# Altium schematic sheet FPGA_GTP.SchDoc
size 420 x 297 mm; EDA_Number: ARTIQ; CompanyName: WUT ISE; Organization: WUT ISE; DocumentNumber: 13; SheetNumber: 4; Title2: FPGA GTP; ModifiedDate: -
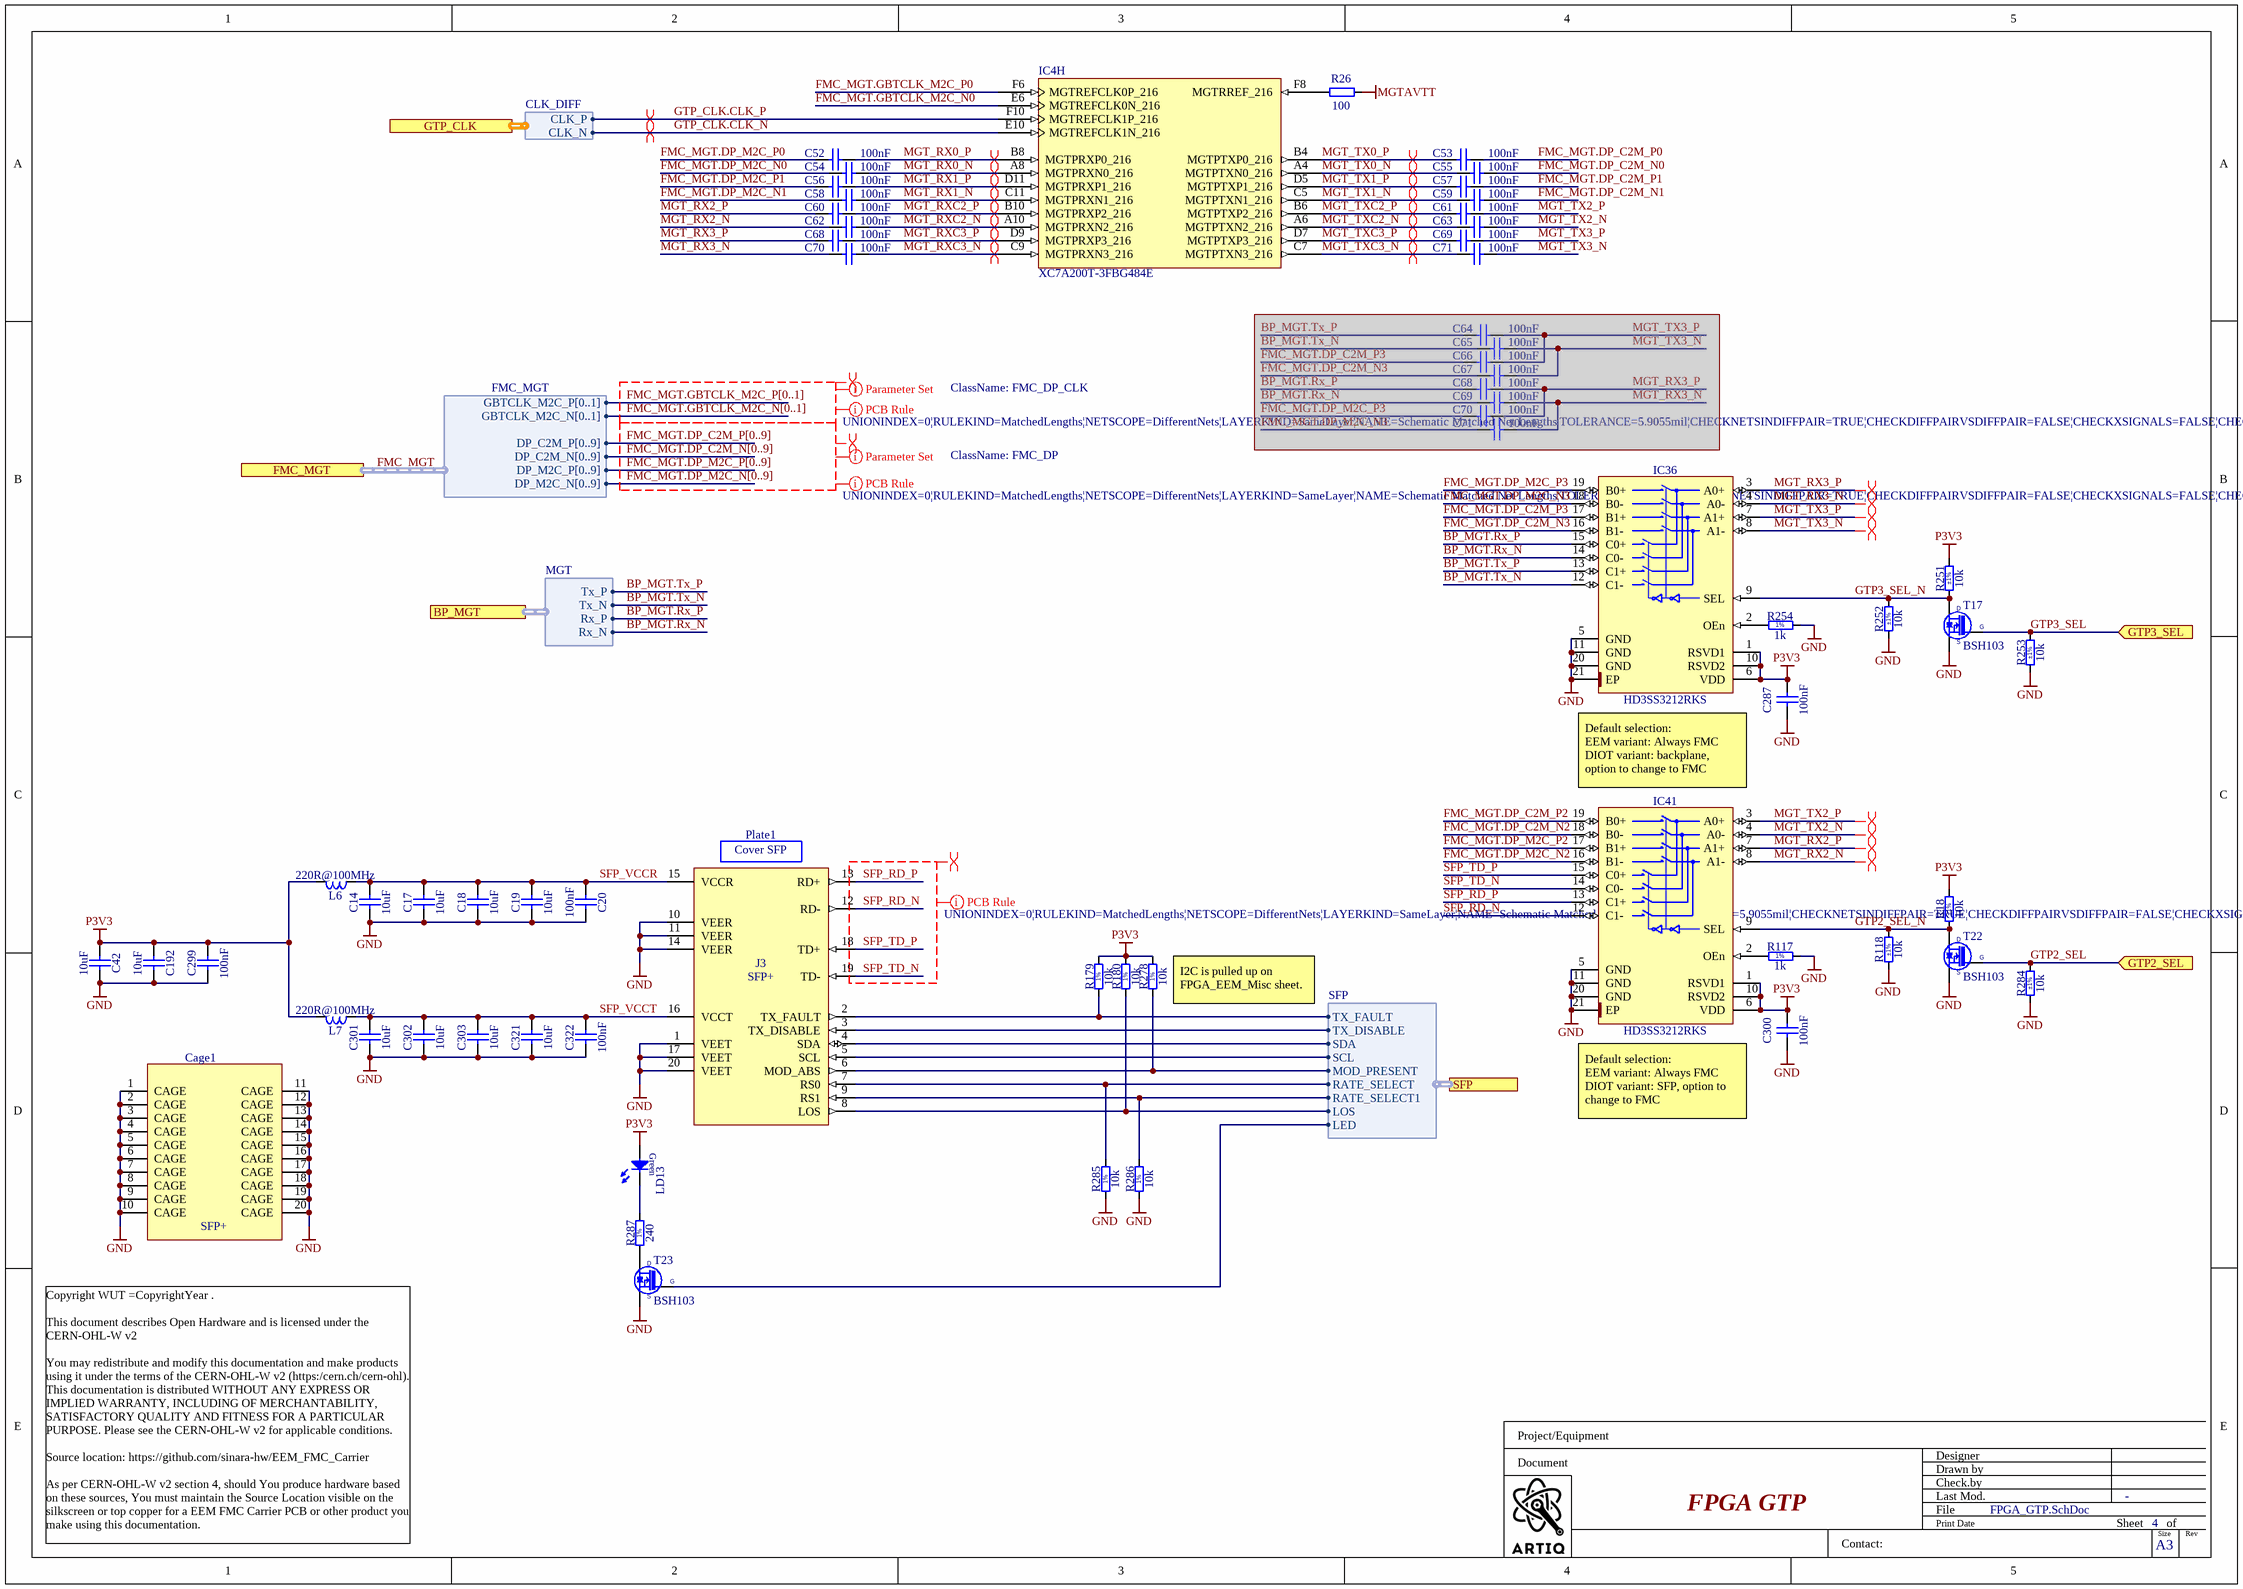
[diagram p0: FPGA_GTP.SchDoc]

## Parts
(Parts that share a designator on the sheet are numbered #1, #2 ... from top to bottom, then left to right.)
C14  10uF  [CAPC1005X70N]
C17  10uF  [CAPC1005X70N]
C18  10uF  [CAPC1005X70N]
C19  10uF  [CAPC1005X70N]
C20  100nF  [CAPC1005X55N]
C42  10uF  [CAPC1005X70N]
C52  100nF  [CAPC0603X33N]
C53  100nF  [CAPC0603X33N]
C54  100nF  [CAPC0603X33N]
C55  100nF  [CAPC0603X33N]
C56  100nF  [CAPC0603X33N]
C57  100nF  [CAPC0603X33N]
C58  100nF  [CAPC0603X33N]
C59  100nF  [CAPC0603X33N]
C60  100nF  [CAPC0603X33N]
C61  100nF  [CAPC0603X33N]
C62  100nF  [CAPC0603X33N]
C63  100nF  [CAPC0603X33N]
C64  100nF  [CAPC0603X33N]  (masked out: inside a compile mask, not in the netlist)
C65  100nF  [CAPC0603X33N]  (masked out: inside a compile mask, not in the netlist)
C66  100nF  [CAPC0603X33N]  (masked out: inside a compile mask, not in the netlist)
C67  100nF  [CAPC0603X33N]  (masked out: inside a compile mask, not in the netlist)
C68#1  100nF  [CAPC0603X33N]
C68#2  100nF  [CAPC0603X33N]  (masked out: inside a compile mask, not in the netlist)
C69#1  100nF  [CAPC0603X33N]
C69#2  100nF  [CAPC0603X33N]  (masked out: inside a compile mask, not in the netlist)
C70#1  100nF  [CAPC0603X33N]
C70#2  100nF  [CAPC0603X33N]  (masked out: inside a compile mask, not in the netlist)
C71#1  100nF  [CAPC0603X33N]
C71#2  100nF  [CAPC0603X33N]  (masked out: inside a compile mask, not in the netlist)
C192  10uF  [CAPC1005X70N]
C287  100nF  [CAPC1005X55N]
C299  100nF  [CAPC1005X55N]
C300  100nF  [CAPC1005X55N]
C301  10uF  [CAPC1005X70N]
C302  10uF  [CAPC1005X70N]
C303  10uF  [CAPC1005X70N]
C321  10uF  [CAPC1005X70N]
C322  100nF  [CAPC1005X55N]
Cage1  SFP+  [TYCO_2007198-1]
IC4  XC7A200T-3FBG484E  [BGA484C100P22X22_2300X2300X254]  (part H of 10)
IC36  HD3SS3212RKS  [TEXAS_RKS0020A]
IC41  HD3SS3212RKS  [TEXAS_RKS0020A]
J3  SFP+  [TYCO_1888247-1]
L6  220R@100MHz  [INDC2012X105N]
L7  220R@100MHz  [INDC2012X105N]
LD13  Green  [LED_AVAGO_HSME-C120]  (value not drawn)
Plate1  Cover SFP  [AMPHENOL_U77A11108000P]
R18  10k  Tolerance: ±1%  [RESC1005X40N]
R26  100  [RESC0603X28N]
R117  1k  [RESC1005X40N]
R118  10k  Tolerance: ±1%  [RESC1005X40N]
R179  10k  [RESC1005X40N]
R180  10k  [RESC1005X40N]
R251  10k  Tolerance: ±1%  [RESC1005X40N]
R252  10k  Tolerance: ±1%  [RESC1005X40N]
R253  10k  Tolerance: ±1%  [RESC1005X40N]
R254  1k  [RESC1005X40N]
R278  10k  [RESC1005X40N]
R284  10k  Tolerance: ±1%  [RESC1005X40N]
R285  10k  [RESC1005X40N]
R286  10k  [RESC1005X40N]
R287  240  [RESC1005X40N]
T17  BSH103  [SOT95P230X110-3N]
T22  BSH103  [SOT95P230X110-3N]
T23  BSH103  [SOT95P230X110-3N]

## Ports
BP_MGT (harness MGT), FMC_MGT (harness FMC_MGT), GTP2_SEL (in), GTP3_SEL (in), GTP_CLK (harness CLK_DIFF), SFP (harness SFP)

## Harnesses
FMC_MGT: GBTCLK_M2C_P[0..1], GBTCLK_M2C_N[0..1], DP_C2M_P[0..9], DP_C2M_N[0..9], DP_M2C_N[0..9], DP_M2C_P[0..9]
MGT: Tx_P, Tx_N, Rx_P, Rx_N
CLK_DIFF: CLK_P, CLK_N
SFP: TX_FAULT, LOS, MOD_PRESENT, TX_DISABLE, RATE_SELECT, LED, RATE_SELECT1, SDA, SCL

## Nets
GND: C14.1 C17.1 C18.1 C19.1 C20.2 C42.1 C192.1 C287.1 C299.2 C300.1 C301.1 C302.1 C303.1 C321.1 C322.2 Cage1.1(CAGE) Cage1.2(CAGE) Cage1.3(CAGE) Cage1.4(CAGE) Cage1.5(CAGE) Cage1.6(CAGE) Cage1.7(CAGE) Cage1.8(CAGE) Cage1.9(CAGE) Cage1.10(CAGE) Cage1.11(CAGE) Cage1.12(CAGE) Cage1.13(CAGE) Cage1.14(CAGE) Cage1.15(CAGE) Cage1.16(CAGE) Cage1.17(CAGE) Cage1.18(CAGE) Cage1.19(CAGE) Cage1.20(CAGE) IC36.5(GND) IC36.11(GND) IC36.20(GND) IC36.21(EP) IC41.5(GND) IC41.11(GND) IC41.20(GND) IC41.21(EP) J3.1(VEET) J3.10(VEER) J3.11(VEER) J3.14(VEER) J3.17(VEET) J3.20(VEET) R117.2 R118.1 R252.1 R253.1 R254.2 R284.1 R285.1 R286.1 T17.2(S) T22.2(S) T23.2(S)
MGTAVTT: R26.1
P3V3: C42.2 C192.2 C287.2 C299.1 C300.2 IC36.1(RSVD1) IC36.6(VDD) IC36.10(RSVD2) IC41.1(RSVD1) IC41.6(VDD) IC41.10(RSVD2) L6.2 L7.2 LD13.2(A) R18.2 R179.2 R180.2 R251.2 R278.2
BP_MGT.Rx_N: IC36.14(C0-) ; port BP_MGT.Rx_N
BP_MGT.Rx_P: IC36.15(C0+) ; port BP_MGT.Rx_P
BP_MGT.Tx_N: IC36.12(C1-) ; port BP_MGT.Tx_N
BP_MGT.Tx_P: IC36.13(C1+) ; port BP_MGT.Tx_P
FMC_MGT.DP_C2M_N0: C55.2
FMC_MGT.DP_C2M_N1: C59.2
FMC_MGT.DP_C2M_N2: IC41.18(B0-)
FMC_MGT.DP_C2M_N3: IC36.16(B1-)
FMC_MGT.DP_C2M_P0: C53.2
FMC_MGT.DP_C2M_P1: C57.2
FMC_MGT.DP_C2M_P2: IC41.19(B0+)
FMC_MGT.DP_C2M_P3: IC36.17(B1+)
FMC_MGT.DP_M2C_N0: C54.1
FMC_MGT.DP_M2C_N1: C58.1
FMC_MGT.DP_M2C_N2: IC41.16(B1-)
FMC_MGT.DP_M2C_N3: IC36.18(B0-)
FMC_MGT.DP_M2C_P0: C52.1
FMC_MGT.DP_M2C_P1: C56.1
FMC_MGT.DP_M2C_P2: IC41.17(B1+)
FMC_MGT.DP_M2C_P3: IC36.19(B0+)
FMC_MGT.GBTCLK_M2C_N0: IC4.E6(MGTREFCLK0N_216)
FMC_MGT.GBTCLK_M2C_P0: IC4.F6(MGTREFCLK0P_216)
GTP2_SEL: R284.2 T22.1(G) ; port GTP2_SEL
GTP2_SEL_N: IC41.9(SEL) R18.1 R118.2 T22.3(D)
GTP3_SEL: R253.2 T17.1(G) ; port GTP3_SEL
GTP3_SEL_N: IC36.9(SEL) R251.1 R252.2 T17.3(D)
GTP_CLK.CLK_N: IC4.E10(MGTREFCLK1N_216) ; port GTP_CLK.CLK_N
GTP_CLK.CLK_P: IC4.F10(MGTREFCLK1P_216) ; port GTP_CLK.CLK_P
MGT_RX0_N: C54.2 IC4.A8(MGTPRXN0_216)
MGT_RX0_P: C52.2 IC4.B8(MGTPRXP0_216)
MGT_RX1_N: C58.2 IC4.C11(MGTPRXN1_216)
MGT_RX1_P: C56.2 IC4.D11(MGTPRXP1_216)
MGT_RX2_N: C62.1 IC41.8(A1-)
MGT_RX2_P: C60.1 IC41.7(A1+)
MGT_RX3_N: C70#1.1 IC36.4(A0-)
MGT_RX3_P: C68#1.1 IC36.3(A0+)
MGT_RXC2_N: C62.2 IC4.A10(MGTPRXN2_216)
MGT_RXC2_P: C60.2 IC4.B10(MGTPRXP2_216)
MGT_RXC3_N: C70#1.2 IC4.C9(MGTPRXN3_216)
MGT_RXC3_P: C68#1.2 IC4.D9(MGTPRXP3_216)
MGT_TX0_N: C55.1 IC4.A4(MGTPTXN0_216)
MGT_TX0_P: C53.1 IC4.B4(MGTPTXP0_216)
MGT_TX1_N: C59.1 IC4.C5(MGTPTXN1_216)
MGT_TX1_P: C57.1 IC4.D5(MGTPTXP1_216)
MGT_TX2_N: C63.2 IC41.4(A0-)
MGT_TX2_P: C61.2 IC41.3(A0+)
MGT_TX3_N: C71#1.2 IC36.8(A1-)
MGT_TX3_P: C69#1.2 IC36.7(A1+)
MGT_TXC2_N: C63.1 IC4.A6(MGTPTXN2_216)
MGT_TXC2_P: C61.1 IC4.B6(MGTPTXP2_216)
MGT_TXC3_N: C71#1.1 IC4.C7(MGTPTXN3_216)
MGT_TXC3_P: C69#1.1 IC4.D7(MGTPTXP3_216)
SFP_RD_N: IC41.12(C1-) J3.12(RD-)
SFP_RD_P: IC41.13(C1+) J3.13(RD+)
SFP_TD_N: IC41.14(C0-) J3.19(TD-)
SFP_TD_P: IC41.15(C0+) J3.18(TD+)
SFP_VCCR: C14.2 C17.2 C18.2 C19.2 C20.1 J3.15(VCCR) L6.1
SFP_VCCT: C301.2 C302.2 C303.2 C321.2 C322.1 J3.16(VCCT) L7.1
NetIC4_F8: IC4.F8(MGTRREF_216) R26.2
NetIC36_2: IC36.2(OEn) R254.1
NetIC41_2: IC41.2(OEn) R117.1
NetJ3_2: J3.2(TX_FAULT) R179.1 ; port SFP.TX_FAULT
NetJ3_3: J3.3(TX_DISABLE) ; port SFP.TX_DISABLE
NetJ3_4: J3.4(SDA) ; port SFP.SDA
NetJ3_5: J3.5(SCL) ; port SFP.SCL
NetJ3_6: J3.6(MOD_ABS) R278.1 ; port SFP.MOD_PRESENT
NetJ3_7: J3.7(RS0) R285.2 ; port SFP.RATE_SELECT
NetJ3_8: J3.8(LOS) R180.1 ; port SFP.LOS
NetJ3_9: J3.9(RS1) R286.2 ; port SFP.RATE_SELECT1
NetLD13_1: LD13.1(C) R287.2
NetR287_1: R287.1 T23.3(D)
NetT23_1: T23.1(G) ; port SFP.LED

## Buses and harness runs
bus FMC_MGT.DP_C2M_N[0..9]
bus FMC_MGT.DP_C2M_P[0..9]
bus FMC_MGT.DP_M2C_N[0..9]
bus FMC_MGT.DP_M2C_P[0..9]
bus FMC_MGT.GBTCLK_M2C_N[0..1]
bus FMC_MGT.GBTCLK_M2C_P[0..1]
harness FMC_MGT = port FMC_MGT

## Layout directives
differential pair; differential pair class MGT: FMC_MGT.DP_C2M_N[0..9], FMC_MGT.DP_C2M_P[0..9], FMC_MGT.DP_M2C_N[0..9], FMC_MGT.DP_M2C_P[0..9], MGT_RX0_N, MGT_RX0_P, MGT_RX1_N, MGT_RX1_P, MGT_RX2_N, MGT_RX2_P, MGT_RX3_N, MGT_RX3_P, MGT_RXC2_N, MGT_RXC2_P, MGT_RXC3_N, MGT_RXC3_P, MGT_TX0_N, MGT_TX0_P, MGT_TX1_N, MGT_TX1_P, MGT_TX2_N, MGT_TX2_P, MGT_TX3_N, MGT_TX3_P, MGT_TXC2_N, MGT_TXC2_P, MGT_TXC3_N, MGT_TXC3_P, SFP_RD_N, SFP_RD_P, SFP_TD_N, SFP_TD_P
net class FMC_DP: FMC_MGT.DP_C2M_N[0..9], FMC_MGT.DP_C2M_P[0..9], FMC_MGT.DP_M2C_N[0..9], FMC_MGT.DP_M2C_P[0..9]
rule Matched Net Lengths [Delay Tolerance = 1ps]: FMC_MGT.DP_C2M_N[0..9], FMC_MGT.DP_C2M_P[0..9], FMC_MGT.DP_M2C_N[0..9], FMC_MGT.DP_M2C_P[0..9], SFP_RD_N, SFP_RD_P, SFP_TD_N, SFP_TD_P
differential pair; differential pair class Diff_100Ohm: FMC_MGT.GBTCLK_M2C_N[0..1], FMC_MGT.GBTCLK_M2C_P[0..1]
net class FMC_DP_CLK: FMC_MGT.GBTCLK_M2C_N[0..1], FMC_MGT.GBTCLK_M2C_P[0..1]
rule Matched Net Lengths [Delay Tolerance = 11ps]: FMC_MGT.GBTCLK_M2C_N[0..1], FMC_MGT.GBTCLK_M2C_P[0..1]
differential pair: GTP_CLK.CLK_N, GTP_CLK.CLK_P

## Notes on the sheet
- Default selection:
  EEM variant: Always FMC
  DIOT variant: backplane, option to change to FMC
- (near R278) I2C is pulled up on FPGA_EEM_Misc sheet.
- Default selection:
  EEM variant: Always FMC
  DIOT variant: SFP, option to change to FMC
- Project/Equipment
- Document
- Designer
- Drawn by
- Check.by
- Copyright WUT =CopyrightYear .
  This document describes Open Hardware and is licensed under the CERN-OHL-W v2
  You may redistribute and modify this documentation and make products using it under the terms of the CERN-OHL-W v2 (https:/cern.ch/cern-ohl). This documentation is distributed WITHOUT ANY EXPRESS OR IMPLIED WARRANTY, INCLUDING OF MERCHANTABILITY, SATISFACTORY QUALITY AND FITNESS FOR A PARTICULAR PURPOSE. Please see the CERN-OHL-W v2 for applicable conditions.
  Source location: https://github.com/sinara-hw/EEM_FMC_Carrier
  As per CERN-OHL-W v2 section 4, should You produce hardware based on these sources, You must maintain the Source Location visible on the silkscreen or top copper for a EEM FMC Carrier PCB or other product you make using this documentation.
- Contact:
- File
- Last Mod.
- Print Date
- Sheet
- Size
- A3
- of
- Rev
- (in symbol R0402_1K_1%_0.0625W_100PPM) 1%
- (in symbol R0402_10K_1%_0.0625W_100PPM) 1%
- (in symbol R0402_240R_1%_0.0625W_100PPM) 1%

## Library data of the parts
C14 C17-C19 C42 C192 C301-C303 C321 = CC0402_10UF_6.3V_20%_X5R: Non-polarised capacitor; Part Description: SMD Multilayer Chip Ceramic Capacitor; Manufacturer: GENERIC; Manufacturer1 Part Number: C1005X5R0J106M050BC; Voltage: 6.3V; TC: X5R; Tolerance: ±10%; Part Number: CC0402_10UF_6.3V_20%_X5R; Component Kind: Standard; Component Type: Standard; Pin Count: 2; Value: 10uF; Status: Preferred; Manufacturer Part Number: CC0402_10UF_6.3V_20%_X5R; Case: 0402; Mounted: Yes; Socket: No; SMD: Yes; Manufacturer1 Example: TDK; Manufacturer1 ComponentHeight: 0.70mm; HelpURL: \\cern.ch\dfs\Applications\Altium\Datasheets\CC0402_X5R_TDK_C.pdf; Author: CERN DEM JLC; CreateDate: 07.01.2015; LatestRevisionDate: 07.01.2015; Sense: No
C20 C287 C299 C300 C322 = CC0402_100NF_25V_10%_X7R_YUDEN_TMK105B7104KVHF: Non-polarised capacitor; Part Description: SMD Multilayer Chip Ceramic Capacitor (High Dielectric Type) for Automotive / Industrial Applications; Manufacturer: TAIYO YUDEN; Voltage: 25V; TC: X7R; Tolerance: ±10%; Part Number: CC0402_100NF_25V_10%_X7R_YUDEN_TMK105B7104KVHF; Component Kind: Standard; Component Type: Standard; Pin Count: 2; Value: 100nF; Status: Not Recommended; Manufacturer Part Number: TMK105B7104KVHF; Case: 0402; Mounted: Yes; Socket: No; SMD: Yes; HelpURL: \\cern.ch\dfs\Applications\Altium\Datasheets\CC0402_TAIYO-YUDEN_TMK105B7104KVHF.pdf; Author: CERN DEM JLC; CreateDate: 10-May-17; LatestRevisionDate: 10-May-17; Sense: No; ComponentHeight: 0.55mm
C52-C67 C68#1 C68#2 C69#1 C69#2 C70#1 C70#2 C71#1 C71#2 = CC0201_100NF_6.3V_10%_X5R: Non-polarised capacitor; Part Description: SMD Multilayer Chip Ceramic Capacitor; Manufacturer: GENERIC; Manufacturer1 Part Number: 02016D104KAT2A; Voltage: 6.3V; TC: X5R; Tolerance: ±10%; Part Number: CC0201_100NF_6.3V_10%_X5R; Component Kind: Standard; Component Type: Standard; Pin Count: 2; Value: 100nF; Status: Not Recommended; Manufacturer Part Number: CC0201_100NF_6.3V_10%_X5R; Case: 0201; Mounted: Yes; Socket: No; SMD: Yes; Manufacturer1 Example: AVX; Manufacturer1 ComponentHeight: 0.33mm; HelpURL: \\cern.ch\dfs\Applications\Altium\Datasheets\CC0201_X5R_AVX.pdf; Author: CERN DEM JLC; CreateDate: 2007-12-03; LatestRevisionDate: 2007-12-03; Sense: No
Cage1 = TYCO_2007198-1: SFP+ 1x1 Cage (20Pins); Part Description: 1x1 Press Fit Cage For Use with SFP+ Connector (Small Form-factor Pluggable); Manufacturer: TYCO ELECTRONICS; Part Number: TYCO_2007198-1; Component Kind: Standard; Component Type: Standard; Pin Count: 20; Family: SFP+; Mounted: Yes; Socket: No; SMD: No; PressFit: Yes; Status: None; Manufacturer Part Number: 2007198-1; ComponentHeight: 9.7mm; HelpURL: \\cern.ch\dfs\Applications\Altium\Datasheets\TYCO_2007198-1.pdf; Author: CERN DEM JLC; CreateDate: 04-Jun-13; LatestRevisionDate: 12-Jun-13; Sense: No
IC4 = XC7A200T-3FBG484E: Artix-7 FPGA, 285 User I/Os, 4 GTP, 484-Ball BGA, Pb-Free; Manufacturer Part Number: XC7A200T-3FBG484E; Device: XC7A200T-3FBG484E
IC36 IC41 = HD3SS3212RKS: Two-Channel Differential 2:1/1:2 USB3.1 Mux/Demux; Manufacturer: TEXAS INSTRUMENTS; PressFit: No; Bonding: No; Part Number: HD3SS3212RKS; Component Kind: Standard; Component Type: Standard; Device: HD3SS3212RKS; PackageDescription: QFN, TEXAS Case Style RKS, 0.50mm Pitch, Rect.; 20 Pin, 2.50mm L X 4.50mm W X 1.00mm H body (w/Thermal Tab 1.1mm X 3.1mm); Part Description: Two-Channel Differential 2:1/1:2 USB3.1 Mux/Demux; Manufacturer Part Number: HD3SS3212RKS; Pin Count: 21; Case: TQFN20; Mounted: Yes; Socket: No; SMD: Yes; Sense: No; ComponentHeight: 1mm; Author: CERN DEM BC; HelpURL: \\cern.ch\dfs\Applications\Altium\Datasheets\HD3SS3212RKS.pdf; CreateDate: 2019-11-06; LatestRevisionDate: 2019-11-06
J3 = TYCO_1888247-1: 20 Position SFP+ Connector (Small Form-factor Pluggable); Part Description: 20 Position, Pitch 0.8mm SFP+ Receptacle (Small Form-factor Pluggable); Manufacturer: TYCO ELECTRONICS; PressFit: No; Part Number: TYCO_1888247-1; Component Kind: Standard; Component Type: Standard; Pin Count: 20; Family: SFP+; Mounted: Yes; Socket: No; SMD: Yes; Status: None; Manufacturer Part Number: 1888247-1; ComponentHeight: 5.4mm; HelpURL: \\cern.ch\dfs\Applications\Altium\Datasheets\TYCO_1888247-1.pdf; Author: CERN DEM JLC; CreateDate: 27-Feb-12; LatestRevisionDate: 27-Feb-12; Sense: No
L6 L7 = IND0805_MURATA_BLM21PG221SN1D: Inductor; Part Description: SMD EMIFIL Suppression Chip Ferrite Bead; Manufacturer: MURATA; Power: 2A; Resistance: 0.05R; Tolerance: ±25%; Part Number: IND0805_MURATA_BLM21PG221SN1D; Component Kind: Standard; Component Type: Standard; Pin Count: 2; Value: 220R@100MHz; Status: None; Manufacturer Part Number: BLM21PG221SN1D; Case: 0805; Mounted: Yes; Socket: No; SMD: Yes; Sense: No; ComponentHeight: 1.05mm; HelpURL: \\cern.ch\dfs\Applications\Altium\Datasheets\IND0805_MURATA_BLM21P.pdf; Author: CERN DEM JLC; CreateDate: 25/01/2010; LatestRevisionDate: 25/01/2010
LD13 = LED_AVAGO_HSME-C120: LED Green 1C 2A; Part Description: High Performance Right Angle Chip Green LED; Manufacturer: AVAGO TECHNOLOGIES; PressFit: No; Bonding: No; Part Number: LED_AVAGO_HSME-C120; Component Kind: Standard; Component Type: Standard; Color: Green; PackageDescription: Green Chip LED, 2-Leads, Body 1.7x1.1mm, Side Emitting Package; Manufacturer Part Number: HSME-C120; Pin Count: 2; Mounted: Yes; Socket: No; SMD: Yes; Sense: No; ComponentHeight: 0.7mm; HelpURL: \\cern.ch\dfs\Applications\Altium\Datasheets\LED_AVAGO_HSME-C120.pdf; ComponentLink1URL: \\cern.ch\dfs\Applications\Altium\Datasheets\LED_AVAGO_HSME-C110_DESIGN-GUIDE.pdf; ComponentLink1Description: Design Guide; Author: CERN DEM JMW; CreateDate: 22.07.2009; LatestRevisionDate: 20.06.2012
Plate1 = AMPHENOL_U77A11108000P: Plastic Dust Cover SFP Cage; PressFit: No; Part Number: AMPHENOL_U77A11108000P; Component Kind: Accessories; Component Type: Standard; Pin Count: 0; PackageDescription: Plastic Dust Cover SFP Cage; Mounted: Yes; Socket: No; SMD: No; Sense: No; Status: None; Value: Cover SFP; Part Description: Plastic Dust Cover SFP Cage; Manufacturer: AMPHENOL; Manufacturer Part Number: U77A11108000P; ComponentHeight: 10.2mm; HelpURL: \\cern.ch\dfs\Applications\Altium\Datasheets\AMPHENOL_U77A11108000P.pdf; Author: CERN DEM BC; CreateDate: 28.10.2019; LatestRevisionDate: 28.10.2019
R18 R118 R179 R180 R251-R253 R278 R284-R286 = R0402_10K_1%_0.0625W_100PPM: Resistor - 1%; Part Description: General Purpose Thick Film Chip Resistor; Manufacturer: GENERIC; Manufacturer1 Part Number: 232270671003L; TC: ±100ppm/°C; PressFit: No; Part Number: R0402_10K_1%_0.0625W_100PPM; Component Kind: Standard; Component Type: Standard; Pin Count: 2; Value: 10k; Status: Not Recommended; Power: 0.0625W; Manufacturer Part Number: R0402_10K_1%_0.0625W_100PPM; Case: 0402; Mounted: Yes; Sense: No; Socket: No; SMD: Yes; Manufacturer1 Example: YAGEO PHYCOMP; Manufacturer1 ComponentHeight: 0.4mm; HelpURL: \\cern.ch\dfs\Applications\Altium\Datasheets\R0402_Phycomp_RC0402.pdf; Author: CERN DEM JLC
  R18 R118 R251-R253 R284: CreateDate: 2007-12-03; LatestRevisionDate: 2012-10-17
  R179 R180 R278 R285 R286: Tolerance: ±1%; CreateDate: 03.12.2007; LatestRevisionDate: 17.10.2012
R26 = R0201_100R_1%_0.05W_200PPM: Resistor - 1%; Part Description: Thick Film Chip Resistor; Manufacturer: GENERIC; Manufacturer1 Part Number: CRCW0201100RFNED; Power: 0.05W; TC: ±200ppm/°C; PressFit: No; Part Number: R0201_100R_1%_0.05W_200PPM; Component Kind: Standard; Component Type: Standard; Pin Count: 2; Value: 100; Status: Not Recommended; Tolerance: ±1%; Manufacturer Part Number: R0201_100R_1%_0.05W_200PPM; Case: 0201; Mounted: Yes; Sense: No; Socket: No; SMD: Yes; Manufacturer1 Example: VISHAY; Manufacturer1 ComponentHeight: 0.27mm; HelpURL: \\cern.ch\dfs\Applications\Altium\Datasheets\R0201_VISHAY_CRCW e3.pdf; Author: CERN DEM JLC; CreateDate: 13.11.2014; LatestRevisionDate: 13.11.2014
R117 R254 = R0402_1K_1%_0.0625W_100PPM: Resistor - 1%; Part Description: General Purpose Thick Film Chip Resistor; Manufacturer: GENERIC; Manufacturer1 Part Number: 232270671002L; TC: ±100ppm/°C; PressFit: No; Part Number: R0402_1K_1%_0.0625W_100PPM; Component Kind: Standard; Component Type: Standard; Pin Count: 2; Value: 1k; Status: Not Recommended; Power: 0.0625W; Tolerance: ±1%; Manufacturer Part Number: R0402_1K_1%_0.0625W_100PPM; Case: 0402; Mounted: Yes; Sense: No; Socket: No; SMD: Yes; Manufacturer1 Example: YAGEO PHYCOMP; Manufacturer1 ComponentHeight: 0.4mm; HelpURL: \\cern.ch\dfs\Applications\Altium\Datasheets\R0402_Phycomp_RC0402.pdf; Author: CERN DEM JLC; CreateDate: 2007-12-03; LatestRevisionDate: 2012-10-17
R287 = R0402_240R_1%_0.0625W_100PPM: Resistor - 1%; Part Description: General Purpose Thick Film Chip Resistor; Manufacturer: GENERIC; Manufacturer1 Part Number: 232270672401L; TC: ±100ppm/°C; PressFit: No; Part Number: R0402_240R_1%_0.0625W_100PPM; Component Kind: Standard; Component Type: Standard; Pin Count: 2; Value: 240; Status: Not Recommended; Power: 0.0625W; Tolerance: ±1%; Manufacturer Part Number: R0402_240R_1%_0.0625W_100PPM; Case: 0402; Mounted: Yes; Sense: No; Socket: No; SMD: Yes; Manufacturer1 Example: YAGEO PHYCOMP; Manufacturer1 ComponentHeight: 0.4mm; HelpURL: \\cern.ch\dfs\Applications\Altium\Datasheets\R0402_Phycomp_RC0402.pdf; Author: CERN DEM JLC; CreateDate: 03.12.2007; LatestRevisionDate: 17.10.2012
T17 T22 T23 = BSH103: N-CHANNEL MOSFET WITH DIODE; Part Description: 30V 850mA N-Channel Enhancement Mode Field-Effect Transistor; Manufacturer: NEXPERIA; PressFit: No; Bonding: No; Part Number: BSH103; Component Kind: Standard; Component Type: Standard; Device: BSH103; PackageDescription: SOT23, 3 pin, Pitch 0.95mm - 1.3mm W X 2.9mm L X 1.1mm H, IPC Medium Density; Manufacturer Part Number: BSH103; Pin Count: 3; Case: SOT23-3; Mounted: Yes; Socket: No; SMD: Yes; Sense: No; ComponentHeight: 1.1mm; HelpURL: \\cern.ch\dfs\Applications\Altium\Datasheets\BSH103.pdf; Author: CERN DEM JLC; CreateDate: 16.03.2010; LatestRevisionDate: 20.06.2017
  T17 T22: ClassName: Artix